# Altium schematic sheet ST_SYS_Board_Clocking.schdoc
size 420 x 297 mm; EDA_Number: ARTIQ; Author: G.Kasprowicz; CompanyName: WUT ISE; DrawnBy: G.Kasprowicz; Organization: WUT ISE; DocumentNumber: 13; SheetNumber: 13; ModifiedBy: -; CheckedDate: -; Title2: Clock distribution; Designer: G.Kasprowicz; ModifiedDate: -; ProjectName: Sensor Box
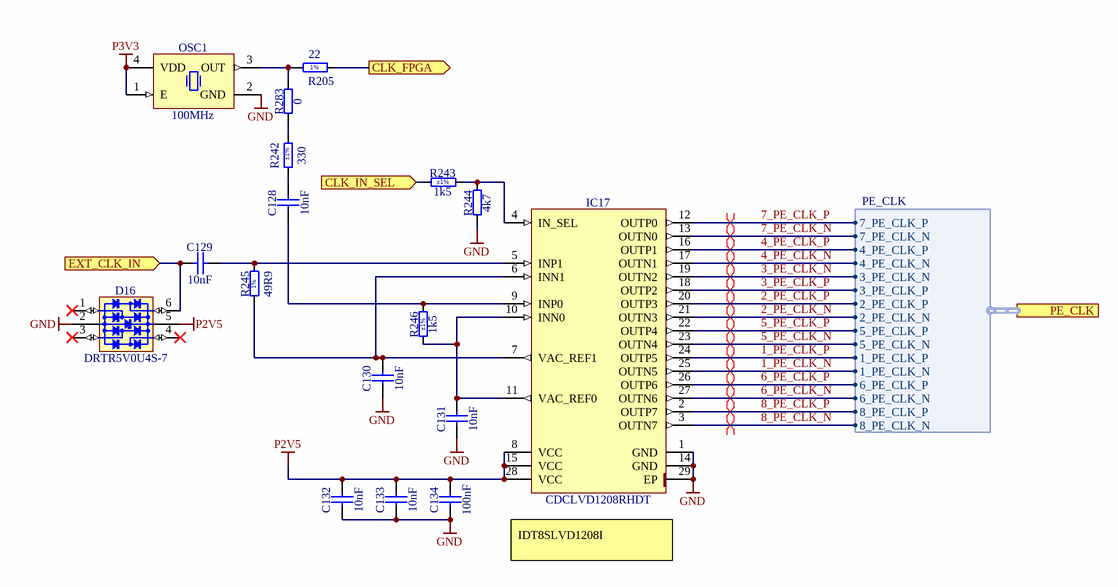
[diagram p0: ST_SYS_Board_Clocking.schdoc]

## Parts
C128  10nF  [CAPC0603X33N]
C129  10nF  [CAPC0603X33N]
C130  10nF  [CAPC0603X33N]
C131  10nF  [CAPC0603X33N]
C132  10nF  [CAPC0603X33N]
C133  10nF  [CAPC0603X33N]
C134  100nF  [CAPC1005X55N]
D16  DRTR5V0U4S-7  [SOT65P210X110-6N]
IC17  CDCLVD1208RHDT  [QFN50P500X500X100-29N-S325]
OSC1  100MHz  [OSC_ECS_ECS-3953M]
R205  22  [RESC1005X40N]
R242  330  Tolerance: ±1%  [RESC1005X40N]
R243  1k5  Tolerance: ±1%  [RESC1005X40N]
R244  4k7  [RESC1005X40N]
R245  49R9  [RESC1005X40N]
R246  1k5  Tolerance: ±1%  [RESC1005X40N]
R283  0  [RESC1005X40N]

## Ports
CLK_FPGA (out), CLK_IN_SEL (in), EXT_CLK_IN (in), PE_CLK (harness PE_CLK)

## Harnesses
PE_CLK: 1_PE_CLK_P, 1_PE_CLK_N, 2_PE_CLK_P, 2_PE_CLK_N, 3_PE_CLK_P, 3_PE_CLK_N, 4_PE_CLK_P, 4_PE_CLK_N, 5_PE_CLK_P, 5_PE_CLK_N, 6_PE_CLK_P, 6_PE_CLK_N, 7_PE_CLK_P, 7_PE_CLK_N, 8_PE_CLK_P, 8_PE_CLK_N

## Nets
GND: C130.1 C131.1 C132.1 C133.1 C134.1 D16.2(GND) IC17.1(GND) IC17.14(GND) IC17.29(EP) OSC1.2(GND) R244.1
P2V5: C132.2 C133.2 C134.2 D16.5(VBUS) IC17.8(VCC) IC17.15(VCC) IC17.28(VCC)
P3V3: OSC1.1(E) OSC1.4(VDD)
1_PE_CLK_N: IC17.25(OUTN5) ; port PE_CLK.1_PE_CLK_N
1_PE_CLK_P: IC17.24(OUTP5) ; port PE_CLK.1_PE_CLK_P
2_PE_CLK_N: IC17.21(OUTN3) ; port PE_CLK.2_PE_CLK_N
2_PE_CLK_P: IC17.20(OUTP3) ; port PE_CLK.2_PE_CLK_P
3_PE_CLK_N: IC17.19(OUTN2) ; port PE_CLK.3_PE_CLK_N
3_PE_CLK_P: IC17.18(OUTP2) ; port PE_CLK.3_PE_CLK_P
4_PE_CLK_N: IC17.17(OUTN1) ; port PE_CLK.4_PE_CLK_N
4_PE_CLK_P: IC17.16(OUTP1) ; port PE_CLK.4_PE_CLK_P
5_PE_CLK_N: IC17.23(OUTN4) ; port PE_CLK.5_PE_CLK_N
5_PE_CLK_P: IC17.22(OUTP4) ; port PE_CLK.5_PE_CLK_P
6_PE_CLK_N: IC17.27(OUTN6) ; port PE_CLK.6_PE_CLK_N
6_PE_CLK_P: IC17.26(OUTP6) ; port PE_CLK.6_PE_CLK_P
7_PE_CLK_N: IC17.13(OUTN0) ; port PE_CLK.7_PE_CLK_N
7_PE_CLK_P: IC17.12(OUTP0) ; port PE_CLK.7_PE_CLK_P
8_PE_CLK_N: IC17.3(OUTN7) ; port PE_CLK.8_PE_CLK_N
8_PE_CLK_P: IC17.2(OUTP7) ; port PE_CLK.8_PE_CLK_P
CLK_FPGA: R205.2 ; port CLK_FPGA
CLK_IN_SEL: R243.1 ; port CLK_IN_SEL
EXT_CLK_IN: C129.1 D16.6(I/O4) ; port EXT_CLK_IN
NetC128_1: C128.1 IC17.9(INP0) R246.2
NetC128_2: C128.2 R242.1
NetC129_2: C129.2 IC17.5(INP1) R245.2
NetC130_2: C130.2 IC17.6(INN1) IC17.7(VAC_REF1) R245.1
NetC131_2: C131.2 IC17.10(INN0) IC17.11(VAC_REF0) R246.1
NetIC17_4: IC17.4(IN_SEL) R243.2 R244.2
NetOSC1_3: OSC1.3(OUT) R205.1 R283.2
NetR242_2: R242.2 R283.1

Not connected (* = marked no-connect by the designer): D16 1(I/O1)* 3(I/O2)* 4(I/O3)*

## Layout directives
differential pair; differential pair class PE_CLK: 1_PE_CLK_N, 1_PE_CLK_P, 2_PE_CLK_N, 2_PE_CLK_P, 3_PE_CLK_N, 3_PE_CLK_P, 4_PE_CLK_N, 4_PE_CLK_P, 5_PE_CLK_N, 5_PE_CLK_P, 6_PE_CLK_N, 6_PE_CLK_P, 7_PE_CLK_N, 7_PE_CLK_P, 8_PE_CLK_N, 8_PE_CLK_P

## Notes on the sheet
- IDT8SLVD1208I
- Project/Equipment
- Document
- Designer
- Drawn by
- Check.by
- Copyright WUT =Copy(CurrentDate,7,4)
  This document describes Open Hardware and is licensed under the CERN-OHL-W v2
  You may redistribute and modify this documentation and make products using it under the terms of the CERN-OHL-W v2 (https:/cern.ch/cern-ohl). This documentation is distributed WITHOUT ANY EXPRESS OR IMPLIED WARRANTY, INCLUDING OF MERCHANTABILITY, SATISFACTORY QUALITY AND FITNESS FOR A PARTICULAR PURPOSE. Please see the CERN-OHL-W v2 for applicable conditions.
  Source location: =SourceLocation
  As per CERN-OHL-W v2 section 4, should You produce hardware based on these sources, You must maintain the Source Location visible on the silkscreen or top copper for a =Title1 PCB or other product you make using this documentation.
- Contact:
- File
- Last Mod.
- Print Date
- Sheet
- Size
- A3
- of
- Rev
- (in symbol R0402_22R_1%_0.0625W_100PPM) 1%
- (in symbol R0402_49R9_1%_0.0625W_100PPM) 1%

## Library data of the parts
C128-C133 = CC0201_10NF_10V_10%_X5R: Non-polarised capacitor; Part Description: SMD Multilayer Chip Ceramic Capacitor; Manufacturer: GENERIC; Manufacturer1 Part Number: 0201ZD103KAT2A; Voltage: 10V; TC: X5R; Tolerance: ±10%; Part Number: CC0201_10NF_10V_10%_X5R; Component Kind: Standard; Component Type: Standard; Pin Count: 2; Value: 10nF; Status: Not Recommended; Manufacturer Part Number: CC0201_10NF_10V_10%_X5R; Case: 0201; Mounted: Yes; Socket: No; SMD: Yes; Sense: No; Manufacturer1 Example: AVX; Manufacturer1 ComponentHeight: 0.33mm; HelpURL: \\cern.ch\dfs\Applications\Altium\Datasheets\CC0201_X5R_AVX.pdf; Author: CERN DEM JLC; CreateDate: 03.12.2007; LatestRevisionDate: 03.12.2007
C134 = CC0402_100NF_16V_10%_X5R: Non-polarised capacitor; Part Description: SMD Multilayer Chip Ceramic Capacitor; Manufacturer: GENERIC; Manufacturer1 Part Number: GRM155R61C104KA88D; Voltage: 16V; TC: X5R; Tolerance: ±10%; Part Number: CC0402_100NF_16V_10%_X5R; Component Kind: Standard; Component Type: Standard; Pin Count: 2; Value: 100nF; Status: None; Manufacturer Part Number: CC0402_100NF_16V_10%_X5R; Case: 0402; Mounted: Yes; Socket: No; SMD: Yes; Sense: No; Manufacturer1 Example: MURATA; Manufacturer1 ComponentHeight: 0.55mm; HelpURL: \\cern.ch\dfs\Applications\Altium\Datasheets\CC0402_X5R_MURATA_GRM.pdf; Author: CERN DEM JLC; CreateDate: 10.12.2013; LatestRevisionDate: 10.12.2013
D16 = D_TVS_DRTR5V0U4S-7: Integrated Quad Ultra-Low Capacitance ESD Protection; Part Description: Integrated Quad Ultra-Low Capacitance ESD (±8kV) Protection; Manufacturer: DIODES; PressFit: No; Bonding: No; Status Comment: Active; Part Number: DRTR5V0U4S-7; Component Kind: Standard; Component Type: Standard; Device: DRTR5V0U4S-7; PackageDescription: SOT363, SC70-6, 0.65mm Pitch; 6 Pin, 1.25mm W X 2.00mm L X 1.10mm H body, IPC Medium Density; Status: Active; Manufacturer Part Number: DRTR5V0U4S-7; Pin Count: 6; Case: SOT363; Mounted: Yes; Socket: No; SMD: Yes; Sense: No; ComponentHeight: 1.1mm; HelpURL: \\cern.ch\dfs\Applications\Altium\Datasheets\PRTR5V0U4Y.pdf; Author: GK; CreateDate: 24.01.2017; LatestRevisionDate: 14.09.2020
IC17 = CDCLVD1208RHDT: 2:8 Low Additive Jitter LVDS Buffer; Manufacturer: TEXAS INSTRUMENTS; PressFit: No; Bonding: No; Part Number: CDCLVD1208RHDT; Component Kind: Standard; Component Type: Standard; Device: CDCLVD1208RHDT; PackageDescription: QFN, 0.50mm Pitch, Square; 28 pin, 5.00mm L X 5.00mm W X 1.00mm H body (w/Thermal Tab 3.25 X 3.25mm), IPC Medium Density; Part Description: 2:8 Low Additive Jitter LVDS Buffer; Manufacturer Part Number: CDCLVD1208RHD; Pin Count: 29; Case: QFN28; Mounted: Yes; Socket: No; SMD: Yes; Sense: No; ComponentHeight: 1mm; HelpURL: \\cern.ch\dfs\Applications\Altium\Datasheets\CDCLVD1208RHDT.pdf; Author: CERN DEM JLC; CreateDate: 28.06.2012; LatestRevisionDate: 10.06.2022
OSC1 = OSC_100MHZ_ECS_ECS-3953M-1000-BN: Oscillator 4 pins 1=E/D 2=GND 3=OUT 4=VDD; Part Description: 3.3V, ±50ppm, 15pF, -40 to 85°C, Surface Mount Clock Oscillator (ECS-3951M/3953M-BN Series); Manufacturer: ECS; PressFit: No; Bonding: No; Part Number: OSC_100MHZ_ECS_ECS-3953M-1000-BN; Component Kind: Standard; Component Type: Standard; PackageDescription: SMD Oscillator, 4 pins, 7 x 5mm, ECS-3951/3953M-BN Series; Value: 100MHz; Manufacturer Part Number: ECS-3953M-1000-BN; Pin Count: 4; Mounted: Yes; Socket: No; SMD: Yes; Sense: No; ComponentHeight: 1.7mm; HelpURL: \\cern.ch\dfs\Applications\Altium\Datasheets\OSC_ECS_ECS-3953M-BN.pdf; Author: CERN DEM BC; CreateDate: 07.05.2020; LatestRevisionDate: 07.05.2020
R205 = R0402_22R_1%_0.0625W_100PPM: Resistor - 1%; Part Description: General Purpose Thick Film Chip Resistor; Manufacturer: GENERIC; Manufacturer1 Part Number: 232270672209L; TC: ±100ppm/°C; PressFit: No; Part Number: R0402_22R_1%_0.0625W_100PPM; Component Kind: Standard; Component Type: Standard; Pin Count: 2; Value: 22; Status: Not Recommended; Power: 0.0625W; Tolerance: ±1%; Manufacturer Part Number: R0402_22R_1%_0.0625W_100PPM; Case: 0402; Mounted: Yes; Socket: No; SMD: Yes; Manufacturer1 Example: YAGEO PHYCOMP; Manufacturer1 ComponentHeight: 0.4mm; HelpURL: \\cern.ch\dfs\Applications\Altium\Datasheets\R0402_Phycomp_RC0402.pdf; Author: CERN DEM JLC; CreateDate: 03.12.2007; LatestRevisionDate: 17.10.2012; Sense: No
R242 = R0402_330R_1%_0.0625W_100PPM: Resistor - 1%; Part Description: General Purpose Thick Film Chip Resistor; Manufacturer: GENERIC; Manufacturer1 Part Number: 232270673301L; TC: ±100ppm/°C; PressFit: No; Part Number: R0402_330R_1%_0.0625W_100PPM; Component Kind: Standard; Component Type: Standard; Pin Count: 2; Value: 330; Status: Not Recommended; Power: 0.0625W; Manufacturer Part Number: R0402_330R_1%_0.0625W_100PPM; Case: 0402; Mounted: Yes; Sense: No; Socket: No; SMD: Yes; Manufacturer1 Example: YAGEO PHYCOMP; Manufacturer1 ComponentHeight: 0.4mm; HelpURL: \\cern.ch\dfs\Applications\Altium\Datasheets\R0402_Phycomp_RC0402.pdf; Author: CERN DEM JLC; CreateDate: 03.12.2007; LatestRevisionDate: 17.10.2012
R243 R246 = R0402_1K5_1%_0.0625W_100PPM: Resistor - 1%; Part Description: General Purpose Thick Film Chip Resistor; Manufacturer: GENERIC; Manufacturer1 Part Number: 232270671502L; TC: ±100ppm/°C; PressFit: No; Part Number: R0402_1K5_1%_0.0625W_100PPM; Component Kind: Standard; Component Type: Standard; Pin Count: 2; Value: 1k5; Status: Not Recommended; Power: 0.0625W; Manufacturer Part Number: R0402_1K5_1%_0.0625W_100PPM; Case: 0402; Mounted: Yes; Sense: No; Socket: No; SMD: Yes; Manufacturer1 Example: YAGEO PHYCOMP; Manufacturer1 ComponentHeight: 0.4mm; HelpURL: \\cern.ch\dfs\Applications\Altium\Datasheets\R0402_Phycomp_RC0402.pdf; Author: CERN DEM JLC; CreateDate: 03.12.2007; LatestRevisionDate: 17.10.2012
R244 = R0402_4k7_1%_0.0625W_100PPM: Resistor - 1%; Part Description: General Purpose Thick Film Chip Resistor; Manufacturer: GENERIC; Manufacturer1 Part Number: 232270674702L; TC: ±100ppm/°C; PressFit: No; Part Number: R0402_4K7_1%_0.0625W_100PPM; Component Kind: Standard; Component Type: Standard; Pin Count: 2; Value: 4k7; Status: Not Recommended; Power: 0.0625W; Tolerance: ±1%; Manufacturer Part Number: R0402_4K7_1%_0.0625W_100PPM; Case: 0402; Mounted: Yes; Sense: No; Socket: No; SMD: Yes; Manufacturer1 Example: YAGEO PHYCOMP; Manufacturer1 ComponentHeight: 0.4mm; HelpURL: \\cern.ch\dfs\Applications\Altium\Datasheets\R0402_Phycomp_RC0402.pdf; Author: CERN DEM JLC; CreateDate: 03.12.2007; LatestRevisionDate: 17.10.2012
R245 = R0402_49R9_1%_0.0625W_100PPM: Resistor - 1%; Part Description: General Purpose Thick Film Chip Resistor; Manufacturer: GENERIC; Manufacturer1 Part Number: 232270674999L or RC0402FR-0749R9L; TC: ±100ppm/°C; Table: Resistors SMD; Part Number: R0402_49R9_1%_0.0625W_100PPM; Component Kind: Standard; Component Type: Standard; Pin Count: 2; Value: 49R9; Status: Not recommended; Power: 0.0625W; Tolerance: ±1%; Manufacturer Part Number: R0402_49R9_1%_0.0625W_100PPM; Case: 0402; Mounted: Yes; Socket: No; SMD: Yes; Manufacturer1 Example: YAGEO PHYCOMP; Manufacturer1 ComponentHeight: 0.4mm; HelpURL: \\cern.ch\dfs\Applications\Altium\Datasheets\R0402_Phycomp_RC0402.pdf; Author: CERN DEM JLC; CreateDate: 2012-10-24; LatestRevisionDate: 2012-10-24
R283 = R0402_0R_JUMPER: Resistor; Part Description: 1A (0.05R Max DC Resistance) Zero Ohm Jumper; Manufacturer: GENERIC; Manufacturer1 Part Number: 232270591001L; PressFit: No; Part Number: R0402_0R_JUMPER; Component Kind: Standard; Component Type: Standard; Pin Count: 2; Value: 0; Status: Not Recommended; Manufacturer Part Number: R0402_0R_JUMPER; Case: 0402; Mounted: Yes; Sense: No; Socket: No; SMD: Yes; Manufacturer1 Example: YAGEO PHYCOMP; Manufacturer1 ComponentHeight: 0.4mm; HelpURL: \\cern.ch\dfs\Applications\Altium\Datasheets\R0402_Phycomp_RC0402.pdf; Author: CERN DEM JLC; CreateDate: 03.12.2007; LatestRevisionDate: 17.10.2012